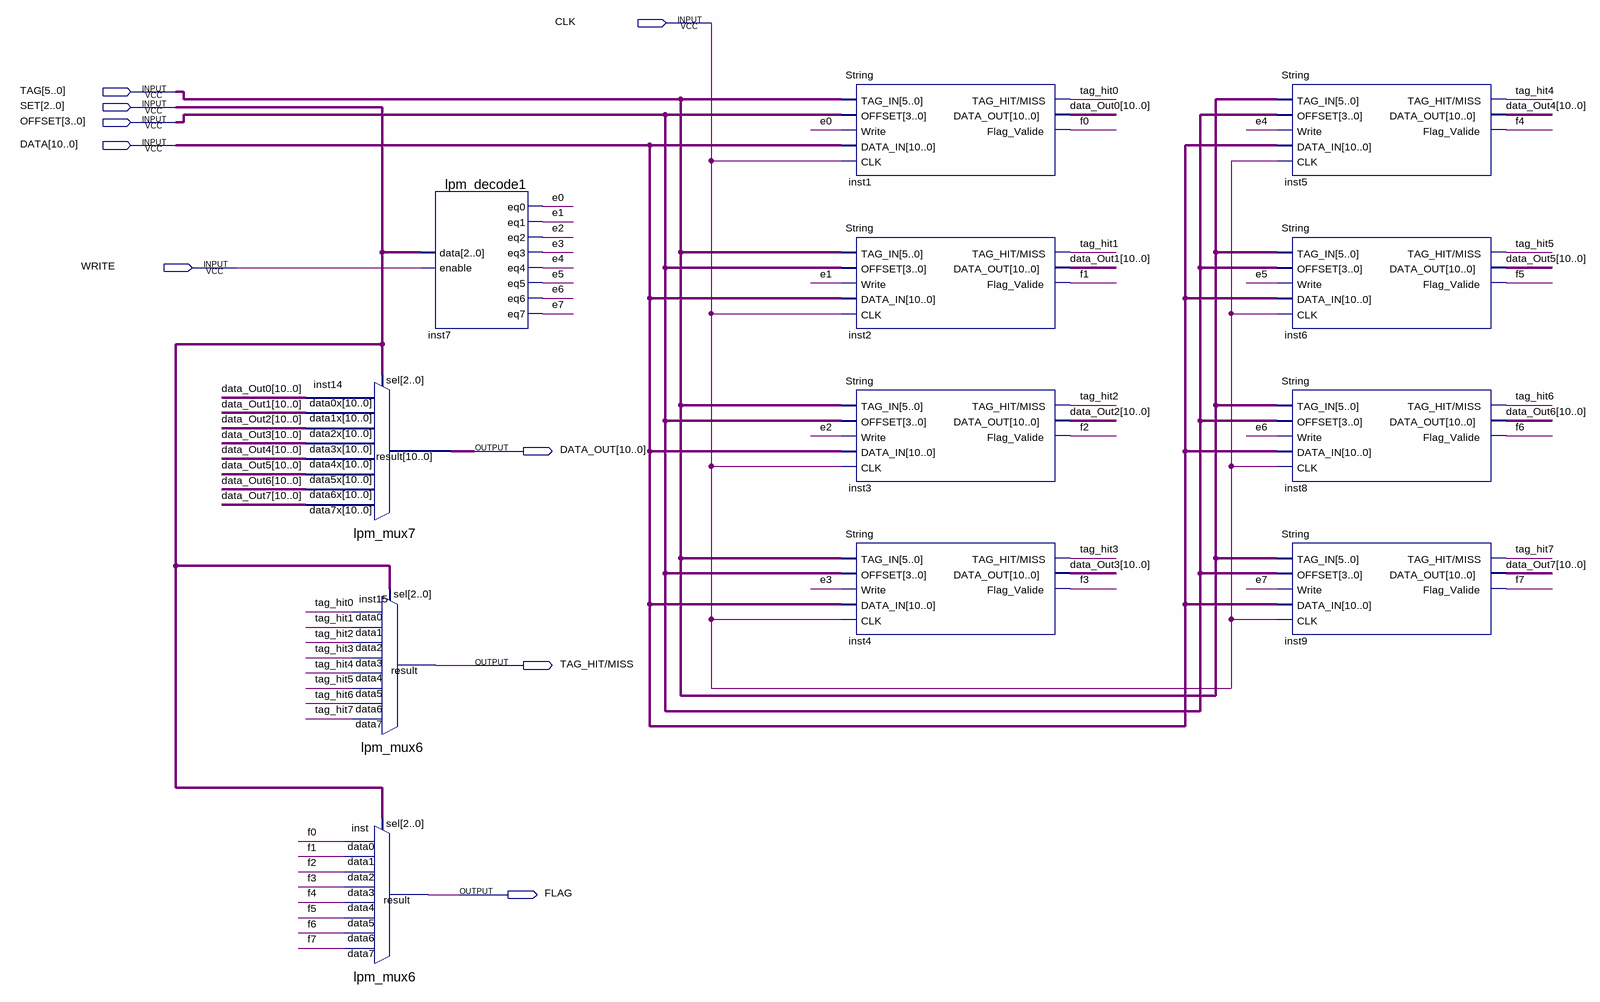
[diagram p0: schematic sheet]
// Quartus schematic Bank.bdf as structural Verilog: 12 symbols, 9 pins
module Bank (
  input  CLK,
  input  [5:0] TAG,
  input  [2:0] SET,
  input  [3:0] OFFSET,
  input  [10:0] DATA,
  input  WRITE,
  output [10:0] DATA_OUT,
  output \TAG_HIT/MISS ,
  output FLAG
);

  wire e0, e1, e2, e3, e4, e5, e6, e7, f0, f1, f2, f3, f4, f5, f6, f7, tag_hit0, tag_hit1, tag_hit2,
       tag_hit3, tag_hit4, tag_hit5, tag_hit6, tag_hit7;
  wire [10:0] data_Out0, data_Out1, data_Out2, data_Out3, data_Out4, data_Out5, data_Out6, data_Out7;

  lpm_mux7 inst14 (
    .data7x(data_Out7), .data6x(data_Out6), .data5x(data_Out5), .data4x(data_Out4), .data3x(data_Out3),
    .data2x(data_Out2), .data1x(data_Out1), .data0x(data_Out0), .sel(SET), .result(DATA_OUT));
  lpm_mux6 inst15 (
    .data7(tag_hit7), .data6(tag_hit6), .data5(tag_hit5), .data4(tag_hit4), .data3(tag_hit3),
    .data2(tag_hit2), .data1(tag_hit1), .data0(tag_hit0), .sel(SET), .result(\TAG_HIT/MISS ));
  lpm_mux6 inst (
    .data7(f7), .data6(f6), .data5(f5), .data4(f4), .data3(f3), .data2(f2), .data1(f1), .data0(f0),
    .sel(SET), .result(FLAG));
  lpm_decode1 inst7 (
    .data(SET), .enable(WRITE), .eq0(e0), .eq1(e1), .eq2(e2), .eq3(e3), .eq4(e4), .eq5(e5), .eq6(e6), .eq7(e7));
  String inst1 (
    .TAG_IN(TAG), .OFFSET(OFFSET), .Write(e0), .DATA_IN(DATA), .CLK(CLK), .\TAG_HIT/MISS (tag_hit0),
    .DATA_OUT(data_Out0), .Flag_Valide(f0));
  String inst2 (
    .TAG_IN(TAG), .OFFSET(OFFSET), .Write(e1), .DATA_IN(DATA), .CLK(CLK), .\TAG_HIT/MISS (tag_hit1),
    .DATA_OUT(data_Out1), .Flag_Valide(f1));
  String inst3 (
    .TAG_IN(TAG), .OFFSET(OFFSET), .Write(e2), .DATA_IN(DATA), .CLK(CLK), .\TAG_HIT/MISS (tag_hit2),
    .DATA_OUT(data_Out2), .Flag_Valide(f2));
  String inst4 (
    .TAG_IN(TAG), .OFFSET(OFFSET), .Write(e3), .DATA_IN(DATA), .CLK(CLK), .\TAG_HIT/MISS (tag_hit3),
    .DATA_OUT(data_Out3), .Flag_Valide(f3));
  String inst5 (
    .TAG_IN(TAG), .OFFSET(OFFSET), .Write(e4), .DATA_IN(DATA), .CLK(CLK), .\TAG_HIT/MISS (tag_hit4),
    .DATA_OUT(data_Out4), .Flag_Valide(f4));
  String inst6 (
    .TAG_IN(TAG), .OFFSET(OFFSET), .Write(e5), .DATA_IN(DATA), .CLK(CLK), .\TAG_HIT/MISS (tag_hit5),
    .DATA_OUT(data_Out5), .Flag_Valide(f5));
  String inst8 (
    .TAG_IN(TAG), .OFFSET(OFFSET), .Write(e6), .DATA_IN(DATA), .CLK(CLK), .\TAG_HIT/MISS (tag_hit6),
    .DATA_OUT(data_Out6), .Flag_Valide(f6));
  String inst9 (
    .TAG_IN(TAG), .OFFSET(OFFSET), .Write(e7), .DATA_IN(DATA), .CLK(CLK), .\TAG_HIT/MISS (tag_hit7),
    .DATA_OUT(data_Out7), .Flag_Valide(f7));
endmodule
